# Altium schematic sheet battery_charger_ni_mh.SchDoc: Battery charger
size A4; SheetNumber: 9; SheetTotal: 20; TitleBig: Battery charging circuitry for Ni-MH; Desc_line1: Battery charger circuit variant #1. By default the device uses a Nickel-metal hydride battery which are chemically and; Desc_line2: thermally more stable (and safer) than Lithium-based ones; at the cost of a lower charge/volume ratio.
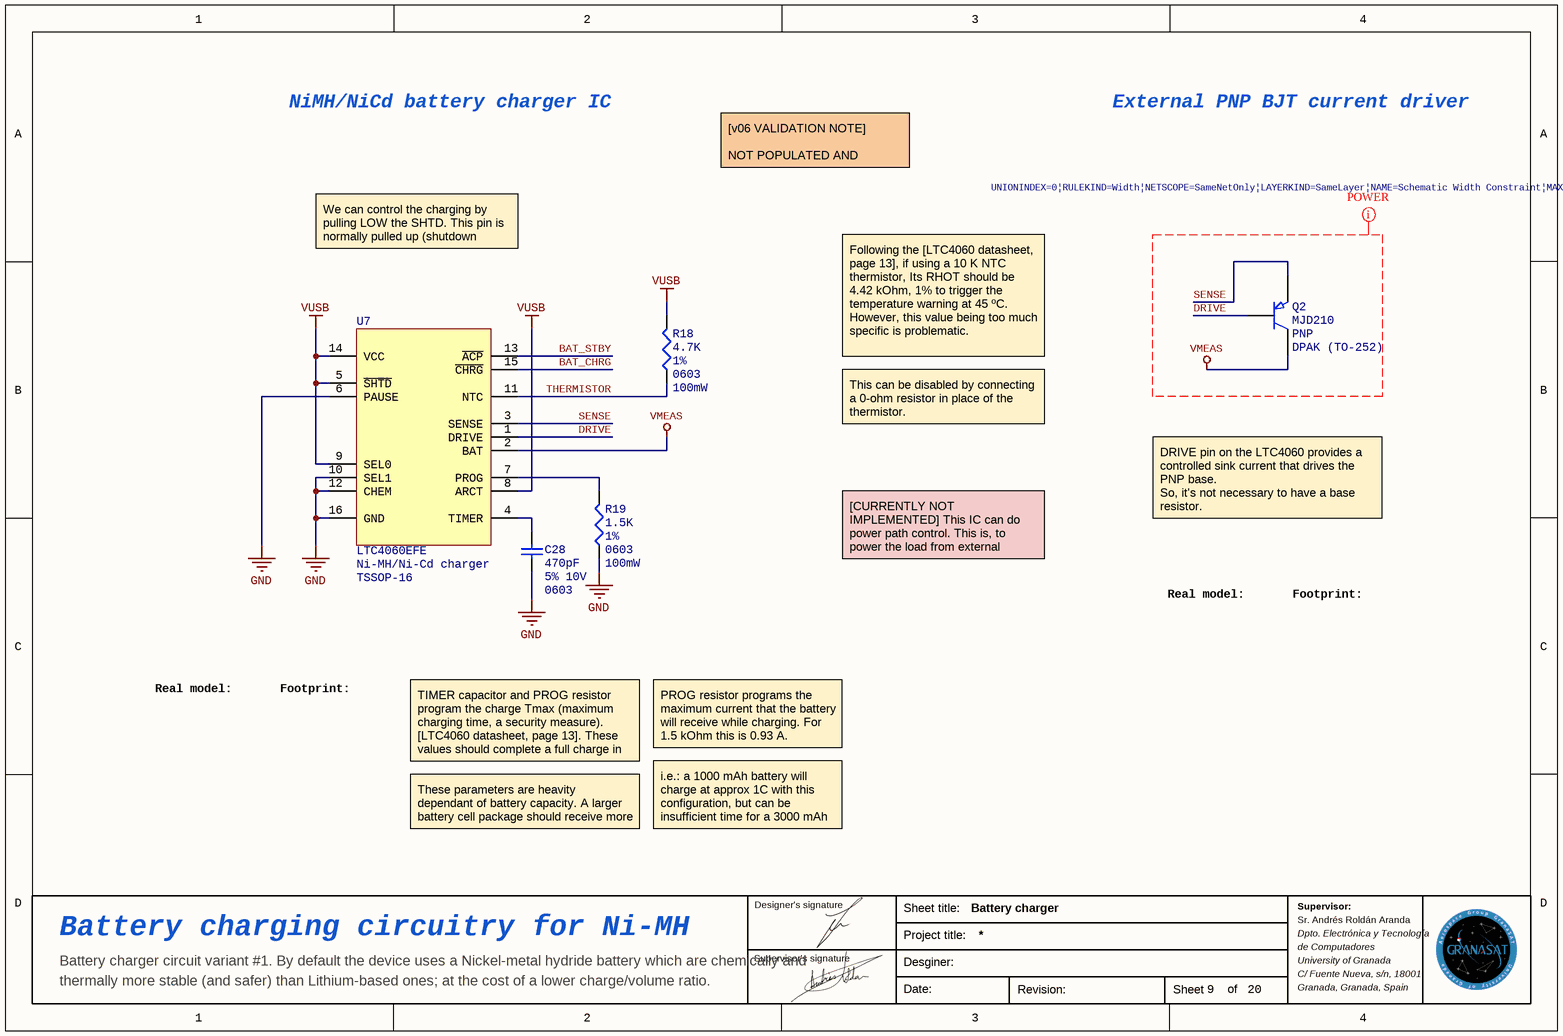
[diagram p0: battery_charger_ni_mh.SchDoc]

## Parts
C28  value 470pF  Tolerance: 5% 10V  PackageDescription: 0603  [CAP 0603_1608]  (hidden comment: Cap_cer_0603_470pF_5%)
Q2  Part: MJD210  Type: PNP  PackageDescription: DPAK (TO-252)  [DPAK TO-252 MJD210]  (hidden comment: PNP BJT MJD210 transistor)
R18  value 4.7K  Tolerance: 1%  PackageDescription: 0603  PowerDisipated: 100mW  [RES 0603_1608]  (hidden comment: Res_0603_4.7K_1%_100mW)
R19  value 1.5K  Tolerance: 1%  PackageDescription: 0603  PowerDisipated: 100mW  [RES 0603_1608]  (hidden comment: Res_0603_1.5K_1%_100mW)
U7  PackageDescription: TSSOP-16  Desc: Ni-MH/Ni-Cd charger  [TSSOP-16 LTC4060EFE]  (hidden comment: IC LTC4060EFE Bat NiMH charger)

## Nets
GND: C28.1 R19.1 U7.6(PAUSE) U7.10(SEL1) U7.12(CHEM) U7.16(GND)
VMEAS: Q2.4(C) U7.2(BAT)
VUSB: R18.2 U7.5(~{SHTD}) U7.8(ARCT) U7.9(SEL0) U7.14(VCC)
BAT_CHRG: U7.15(~{CHRG})
BAT_STBY: U7.13(~{ACP})
DRIVE: Q2.1(B) U7.1(DRIVE)
SENSE: Q2.3(E) U7.3(SENSE)
THERMISTOR: R18.1 U7.11(NTC)
NetC28_2: C28.2 U7.4(TIMER)
NetR19_2: R19.2 U7.7(PROG)

## Layout directives
net class POWER; rule Width Constraint [Pref Width = 0.5mm    Min Width = 0.35mm    Max Width = 0.8mm]: DRIVE, SENSE, VMEAS

## Notes on the sheet
- NiMH/NiCd battery charger IC
- External PNP BJT current driver
- [v06 VALIDATION NOTE]
  NOT POPULATED AND UNTESTED.
- We can control the charging by pulling LOW the SHTD. This pin is normally pulled up (shutdown disabled).
- Following the [LTC4060 datasheet, page 13], if using a 10 K NTC thermistor, Its RHOT should be 4.42 kOhm, 1% to trigger the temperature warning at 45 ºC.
  However, this value being too much specific is problematic.
- This can be disabled by connecting a 0-ohm resistor in place of the thermistor.
- DRIVE pin on the LTC4060 provides a controlled sink current that drives the PNP base.
  So, it's not necessary to have a base resistor.
- [CURRENTLY NOT IMPLEMENTED] This IC can do power path control. This is, to power the load from external source while charging the battery.
- Real model:
- Footprint:
- TIMER capacitor and PROG resistor program the charge Tmax (maximum charging time, a security measure). [LTC4060 datasheet, page 13]. These values should complete a full charge in at most 1 h 6'
- PROG resistor programs the maximum current that the battery will receive while charging. For 1.5 kOhm this is 0.93 A.
- These parameters are heavity dependant of battery capacity. A larger battery cell package should receive more time / current.
- i.e.: a 1000 mAh battery will charge at approx 1C with this configuration, but can be insufficient time for a 3000 mAh one.
- Designer's signature
- Sheet title:
- Sr. Andrés Roldán Aranda
- Supervisor:
- Supervisor's signature
- Project title:
- Desginer:
- Dpto. Electrónica y Tecnología
- de Computadores
- University of Granada
- C/ Fuente Nueva, s/n, 18001
- Granada, Granada, Spain
- Date:
- Revision:
- Sheet
- of

## Library data of the parts
C28 = Cap_cer_0603_470pF_5%: Ceramic cap size 0805; FabGroup: Charger for Ni-MH; FabOrder: 6
Q2 = PNP BJT MJD210 transistor: MJD210 PNP BJT transistor DPAK (decawatt) 5A dc
R18 = Res_0603_4.7K_1%_100mW: Res size 0603 SMD mounting, low power
R19 = Res_0603_1.5K_1%_100mW: Res size 0603 SMD mounting, low power
U7 = IC LTC4060EFE Bat NiMH charger: LTC4060EFE; Part: LTC4060EFE